# EasyEDA Pro project ProPrj_智能警报器（终版）_2025-03-04_22-10-02_2025-04-22.epro, board 警报装置新PCB
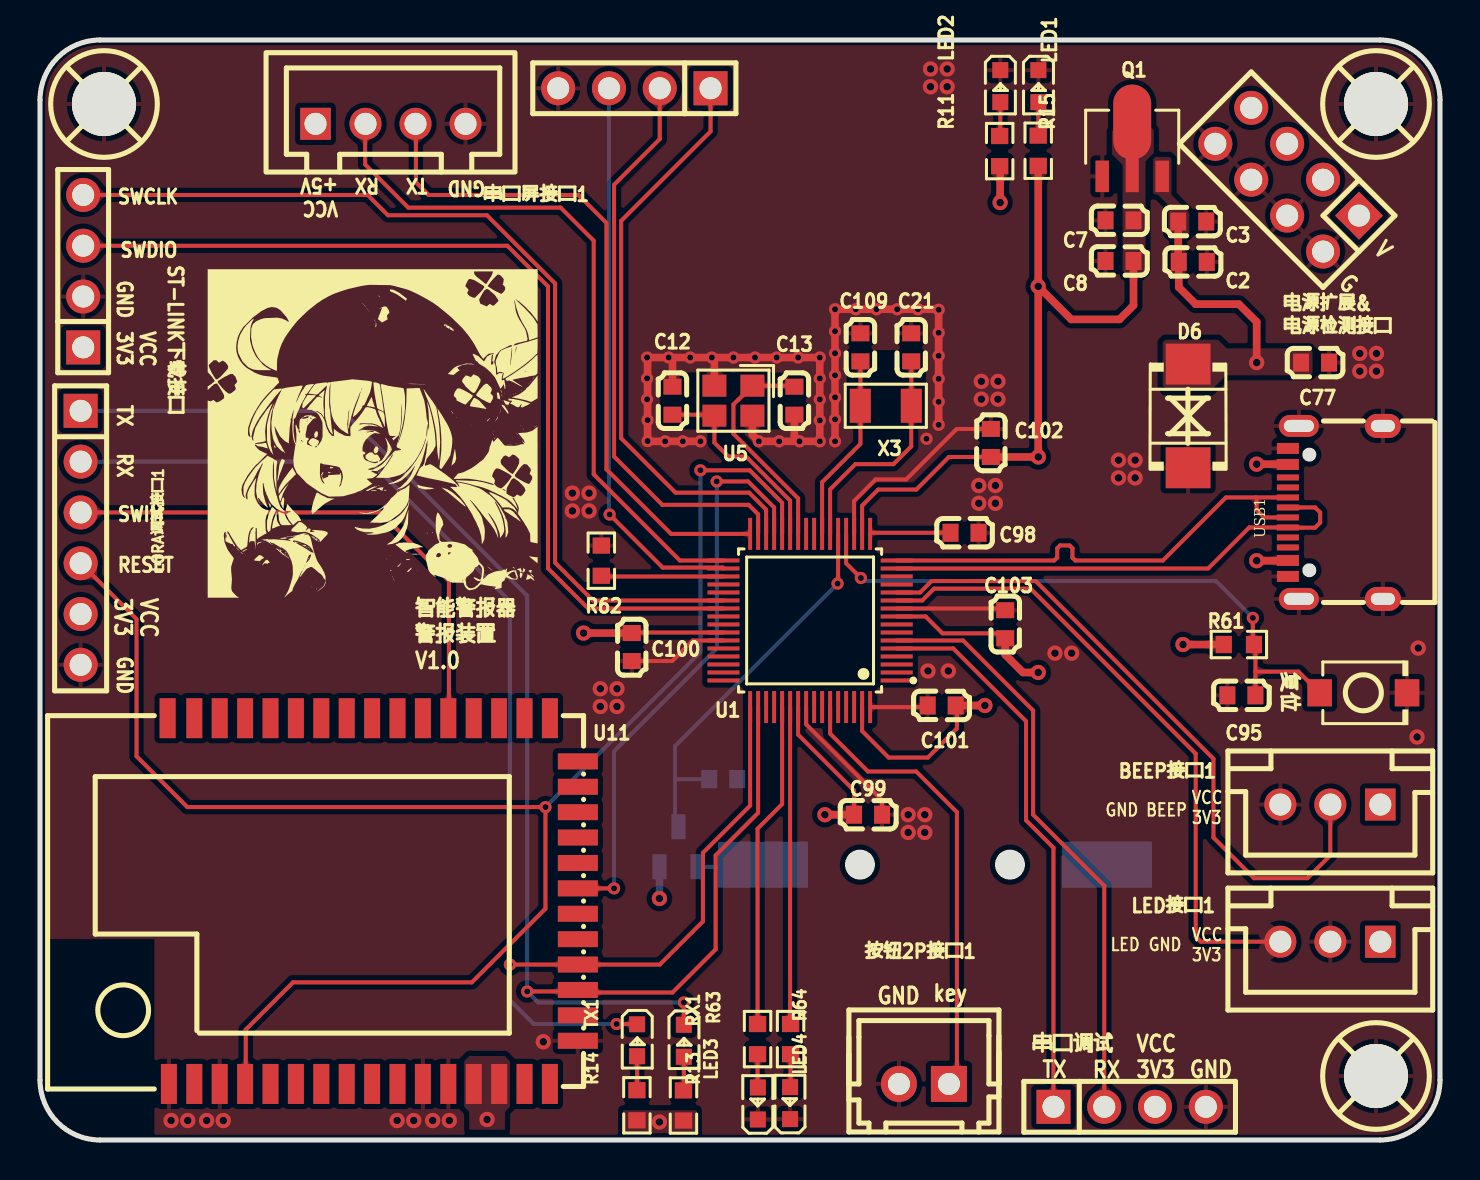
[diagram p16: board, top side]
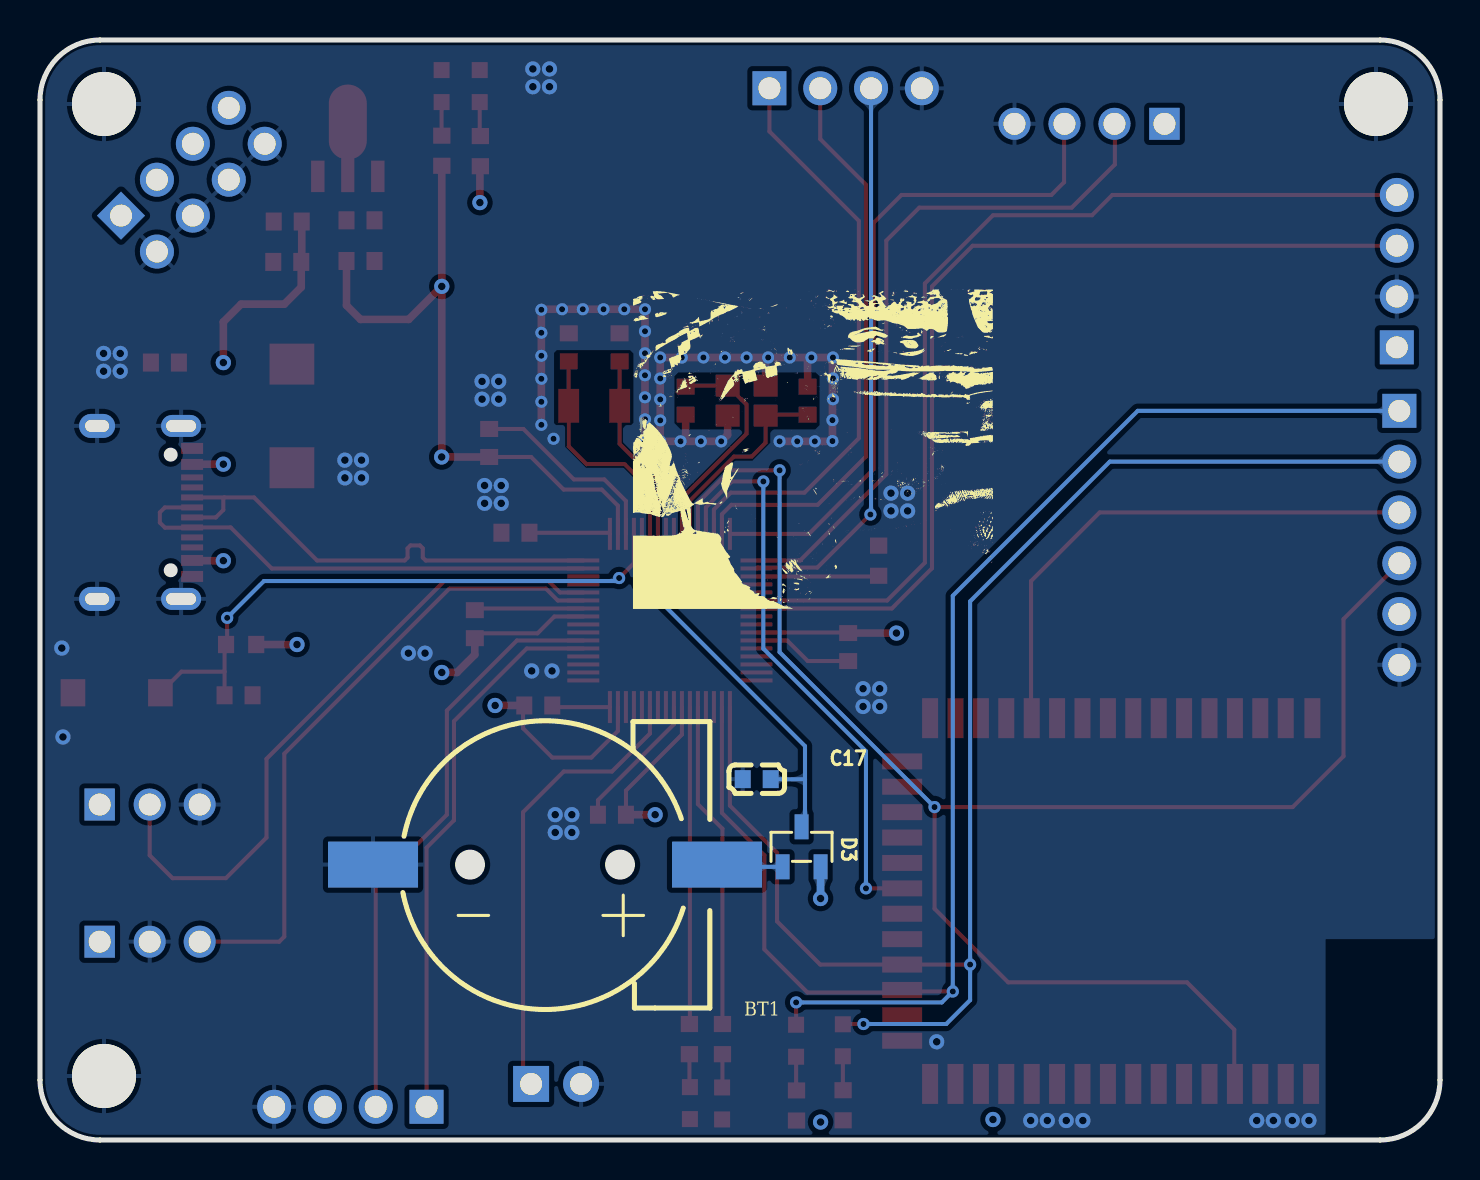
[diagram p17: board, bottom side, seen from below]

Outline 70 x 55 mm; copper layers: Top Layer, 电源层, 接地层, Bottom Layer. Coordinates in mm from the lower left corner of the outline.
Outline path: 0,52 0,3 arc(0.88,0.88) 3,0 67,0 arc(69.12,0.88) 70,3 70,52 arc(69.12,54.12) 67,55 3,55 arc(0.88,54.12) 0,52
Stack: Top Layer 0.035mm 外层铜厚1oz / Dielectric1 0.2104mm 7628 RC49% 8.6mil / 电源层 0.0152mm 内层铜厚 / Dielectric2 1.065mm 1.1mm H/HOZ Copper / 接地层 0.0152mm 内层铜厚 / Dielectric3 0.2104mm 7628 RC49% 8.6mil / Bottom Layer 0.035mm 外层铜厚1oz

## Design rules (mm)
net USBDM: DP1
net USBDP: DP1
template: 自定义配置
spacing copperThickness1oz (default): track to track 0.152, other pairs 0.152 to 0.3
spacing copperThickness2oz: track to track 0.203, other pairs 0.152 to 0.3
spacing copperThicknessInner0.5oz: track to track 0.089, other pairs 0.152 to 0.3
track width copperThickness1oz (default): min 0.203, default 0.203, max 2.54
track width copperThickness2oz: min 0.203, default 0.254, max 2.54
track width GND: min 0.203, default 0.381, max 2.54
track width vcc: min 0.203, default 0.381, max 2.54
differential pair differentialPair (default): width min 0.203, default 0.203, max 2.54; gap min 0.152, default 0.152
via viaSize (default): diameter min 0.3, default 0.61, max 10; hole min 0.201, default 0.305, max 6.299
via vcc: diameter min 0.61, default 0.762, max 1.016; hole min 0.305, default 0.381, max 0.508
net VCC+3.3V uses vcc
net GND uses GND
net VCC+5V uses vcc
net USBDM uses copperThickness2oz
net USBDP uses copperThickness2oz

## Placement (name value [footprint] x y rotation side)
BEEP接口1  ZX-XH2.54-3PZZ-R  [CONN-TH_3P-P2.50_ZX-XH2.54-3PZZ-R]  64.52 16.77 180 top
BT1  CR1220-2ZX  [BAT-SMD_CR1220-2ZX]  44.75 13.77 0 bottom
C2  10uF  [C0603]  57.64 43.91 180 top
C3  100nF  [C0603]  57.61 45.92 180 top
C7  10uF  [C0603]  53.97 45.98 0 top
C8  100nF  [C0603]  53.97 43.95 0 top
C12  12pF  [C0603]  31.62 36.97 90 top
C13  12pF  [C0603]  37.72 36.97 270 top
C17  100nF  [C0603]  34.16 18.04 0 bottom
C21  10pF  [C0603]  43.56 39.63 270 top
C77  10uF  [C0603]  63.75 38.87 180 top
C95  10uF  [C0603]  60.07 22.23 0 top
C98  2.2uF  [C0603]  46.23 30.36 0 top
C99  100nF  [C0603]  41.4 16.27 180 top
C100  100nF  [C0603]  29.59 24.65 90 top
C101  100nF  [C0603]  45.09 21.73 0 top
C102  100nF  [C0603]  47.54 34.85 270 top
C103  100nF  [C0603]  48.26 25.79 270 top
C109  10pF  [C0603]  41.02 39.63 270 top
D3  BAT54C  [SOT-23-3_L2.9-W1.3-P1.90-LS2.4-BR]  31.92 14.66 270 bottom
D6  SMBJ6.8CA  [SMB_L4.6-W3.6-LS5.3-BI]  57.4 36.2 270 top
H8  PZ254V-11-04P  [HDR-TH_4P-P2.54-V-M]  2.16 43.44 90 top
H9  PZ254V-11-04P  [HDR-TH_4P-P2.54-V-M]  29.72 52.59 180 top
LED1  KT-0603R  [LED0603-RD]  49.92 52.69 270 top
LED2  KT-0603R  [LED0603-RD]  48.01 52.69 270 top
LED3  KT-0603R  [LED0603-RD]  35.89 1.83 90 top
LED4  KT-0603R  [LED0603-RD]  37.5 1.84 90 top
LED接口1  ZX-XH2.54-3PZZ-R  [CONN-TH_3P-P2.50_ZX-XH2.54-3PZZ-R]  64.52 9.92 180 top
LORA调试接口1  PZ254-1-06-Z-2.5-G1  [HDR-TH_6P-P2.54-V-M]  2.03 30.11 270 top
Q1  AMS1117-3.3V  [SOT-89-3_L4.5-W2.5-P1.50-LS4.2-BR]  54.61 49.54 270 top
R11  1kΩ  [R0603]  47.98 49.44 270 top
R13  1kΩ  [R0603]  32.17 1.73 270 top
R14  1kΩ  [R0603]  29.84 1.74 270 top
R15  1kΩ  [R0603]  49.91 49.46 270 top
R61  10kΩ  [R0603]  59.94 24.77 180 top
R62  10kΩ  [R0603]  28.07 28.97 270 top
R63  1kΩ  [R0603]  35.88 5.04 90 top
R64  1kΩ  [R0603]  37.53 5.04 90 top
RX1  KT-0603R  [LED0603-RD]  32.19 4.96 270 top
SCREW1  -  [M3螺丝]  66.8 51.8 0 top
SCREW2  -  [M3螺丝]  66.8 3.2 0 top
SCREW3  -  [M3螺丝]  3.2 51.8 0 top
SW1  TS-1088-AR02016  [SW-SMD_L3.9-W3.0-P4.45]  66.17 22.36 0 top
TX1  KT-0603R  [LED0603-RD]  29.86 4.99 270 top
U1  HT32F52352  [LQFP-64_L7.0-W7.0-P0.40-LS9.2-BL]  38.5 25.98 90 top
U5  8MHz  [CRYSTAL-SMD_4P-L2.5-W2.0-BL]  34.67 36.97 180 top
U11  WH-L101-L-C  [COMM-SMD_WH-L101-L-C]  16.64 11.95 90 top
U59  PM254-1-04-Z-8.5  [HDR-TH_4P-P2.54-V-F]  54.48 1.66 0 top
USB1  TYPE-C 16PIN 2MD(073)  [USB-C-SMD_TYPE-C-6PIN-2MD-073]  64.77 31.38 90 top
X3  32.768kHz  [OSC-SMD_L3.2-W1.5]  42.29 36.71 180 top
串口屏接口1  ZX-XH2.54-4PZZ  [CONN-TH_4P-P2.50_4PIN]  17.53 50.81 0 top
扩展电源接口1  PZ254V-12-8P  [HDR-TH_8P-P2.54-V-M-R2-C4-S2.54]  62.36 48.02 135 top
按钮2P接口1  ZX-XH2.54-2PZZ  [CONN-TH_2P-P2.50_HX25003-2A]  44.2 2.8 180 top

## Footprints (pads in the part's own frame, mm; a bottom-side part is the same pattern mirrored in y, then rotated)
BAT-SMD_CR1220-2ZX
  rect 4.5x2.3 smd: 1(-8.6,0) 2(8.6,0)
C0603
  rect 0.8x0.9 smd: 1(-0.7,0) 2(0.7,0)
COMM-SMD_WH-L101-L-C
  rect 2x0.8 smd: 1(-9.144,10.192) 2(-9.144,8.922) 3(-9.144,7.652) 4(-9.144,6.382) 5(-9.144,5.112) 6(-9.144,3.842) 7(-9.144,2.572) 8(-9.144,1.302) 9(-9.144,0.032) 10(-9.144,-1.238) 11(-9.144,-2.509) 12(-9.144,-3.779) 13(-9.144,-5.048) 14(-9.144,-6.319) 15(-9.144,-7.588) 16(-9.144,-8.858) 29(9.144,-8.858) 30(9.144,-7.588) 31(9.144,-6.319) 32(9.144,-5.048) 33(9.144,-3.779) 34(9.144,-2.509) 35(9.144,-1.238) 36(9.144,0.032) 37(9.144,1.302) 38(9.144,2.572) 39(9.144,3.842) 40(9.144,5.112) 41(9.144,6.382) 42(9.144,7.652) 43(9.144,8.922) 44(9.144,10.255)
  rect 0.8x2 smd: 17(-6.985,-10.255) 18(-5.715,-10.255) 19(-4.445,-10.255) 20(-3.175,-10.255) 21(-1.905,-10.255) 22(-0.635,-10.255) 23(0.635,-10.255) 24(1.905,-10.255) 25(3.175,-10.255) 26(4.445,-10.255) 27(5.715,-10.255) 28(6.985,-10.255)
CONN-TH_2P-P2.50_HX25003-2A
  rect 1.8x1.8 hole 1.1: 1(-1.25,0)
  round 1.8 hole 1.1: 2(1.25,0)
CONN-TH_3P-P2.50_ZX-XH2.54-3PZZ-R
  rect 1.524x1.6 hole 1.1: 1(-2.5,0)
  round 1.6 hole 1.1: 2(0,0) 3(2.5,0)
CONN-TH_4P-P2.50_4PIN
  rect 1.524x1.6 hole 1.1: 1(-3.75,0)
  round 1.6 hole 1.1: 2(-1.25,0) 3(1.25,0) 4(3.75,0)
CRYSTAL-SMD_4P-L2.5-W2.0-BL
  rect 1.2x1.1 smd: 1(-0.95,-0.75) 2(0.95,-0.75) 3(0.95,0.75) 4(-0.95,0.75)
HDR-TH_4P-P2.54-V-F
  rect 1.7x1.7 hole 1.1: 1(-3.81,0)
  round 1.7 hole 1.1: 2(-1.27,0) 3(1.27,0) 4(3.81,0)
HDR-TH_4P-P2.54-V-M
  rect 1.7x1.7 hole 1.1: 1(-3.81,0)
  round 1.7 hole 1.1: 2(-1.27,0) 3(1.27,0) 4(3.81,0)
HDR-TH_6P-P2.54-V-M
  rect 1.7x1.7 hole 1.1: 1(-6.35,0)
  round 1.7 hole 1.1: 2(-3.81,0) 3(-1.27,0) 4(1.27,0) 5(3.81,0) 6(6.35,0)
HDR-TH_8P-P2.54-V-M-R2-C4-S2.54
  rect 1.7x1.7 hole 1.1: 1(-3.81,-1.27)
  round 1.7 hole 1.1: 2(-3.81,1.27) 3(-1.27,-1.27) 4(-1.27,1.27) 5(1.27,-1.27) 6(1.27,1.27) 7(3.81,-1.27) 8(3.81,1.27)
LED0603-RD
  rect 0.8x0.8 smd: 1(-0.799,0) 2(0.799,0)
LQFP-64_L7.0-W7.0-P0.40-LS9.2-BL
  rect 0.2x1.6 smd: 1(-3,-4.33) 2(-2.6,-4.33) 3(-2.2,-4.33) 4(-1.8,-4.33) 5(-1.4,-4.33) 6(-1,-4.33) 7(-0.6,-4.33) 8(-0.2,-4.33) 9(0.2,-4.33) 10(0.6,-4.33) 11(1,-4.33) 12(1.4,-4.33) 13(1.8,-4.33) 14(2.2,-4.33) 15(2.6,-4.33) 16(3,-4.33) 33(3,4.33) 34(2.6,4.33) 35(2.2,4.33) 36(1.8,4.33) 37(1.4,4.33) 38(1,4.33) 39(0.6,4.33) 40(0.2,4.33) 41(-0.2,4.33) 42(-0.6,4.33) 43(-1,4.33) 44(-1.4,4.33) 45(-1.8,4.33) 46(-2.2,4.33) 47(-2.6,4.33) 48(-3,4.33)
  rect 1.6x0.2 smd: 17(4.33,-3) 18(4.33,-2.6) 19(4.33,-2.2) 20(4.33,-1.8) 21(4.33,-1.4) 22(4.33,-1) 23(4.33,-0.6) 24(4.33,-0.2) 25(4.33,0.2) 26(4.33,0.6) 27(4.33,1) 28(4.33,1.4) 29(4.33,1.8) 30(4.33,2.2) 31(4.33,2.6) 32(4.33,3) 49(-4.33,3) 50(-4.33,2.6) 51(-4.33,2.2) 52(-4.33,1.8) 53(-4.33,1.4) 54(-4.33,1) 55(-4.33,0.6) 56(-4.33,0.2) 57(-4.33,-0.2) 58(-4.33,-0.6) 59(-4.33,-1) 60(-4.33,-1.4) 61(-4.33,-1.8) 62(-4.33,-2.2) 63(-4.33,-2.6) 64(-4.33,-3)
M3螺丝
  round 3.2 hole 3.2: 1(0,0)
OSC-SMD_L3.2-W1.5
  rect 1.05x1.7 smd: 1(-1.275,0) 2(1.275,0)
R0603
  rect 0.806x0.864 smd: 1(-0.753,0) 2(0.753,0)
SMB_L4.6-W3.6-LS5.3-BI
  rect 2.047x2.241 smd: 1(-2.591,0) 2(2.591,0)
SOT-23-3_L2.9-W1.3-P1.90-LS2.4-BR
  rect 1.25x0.7 smd: 1(1,-0.95) 2(1,0.95) 3(-1,0)
SOT-89-3_L4.5-W2.5-P1.50-LS4.2-BR
  rect 1.575x0.672 smd: 1(1.356,-1.5) 3(1.356,1.5)
  custom 5.377x1.9 smd: 2(-1.356,0)
SW-SMD_L3.9-W3.0-P4.45
  rect 1.23x1.36 smd: 1(-2.185,0) 2(2.185,0)
USB-C-SMD_TYPE-C-6PIN-2MD-073
  rect 0.55x1.1 smd: 1(-3.2,2.375) 2(-2.4,2.375) 11(2.4,2.375) 12(3.2,2.375)
  rect 0.3x1.1 smd: 3(-1.75,2.375) 4(-1.25,2.375) 5(-0.75,2.375) 6(-0.25,2.375) 7(0.25,2.375) 8(0.75,2.375) 9(1.25,2.375) 10(1.75,2.375)
  oval 1.1x2 hole 0.6x1.5: 13(-4.325,1.825) 14(4.325,1.825)
  oval 1.2x1.8 hole 0.6x1.2: 13(-4.325,-2.375) 14(4.325,-2.375)

## Nets
As in the schematic.

Pads without a net: U1 24; U11 2 5 6 7 8 9 10 15 16 18 21 22 24 25 26 27 28 29 30 31 32 34 35 36 37 38 39 40 41 42 43 44; USB1 3 4 9 10

## Via types
v1: diameter 0.762, hole 0.381, Top Layer to Bottom Layer, 61 vias
v2: diameter 0.61, hole 0.305, Top Layer to Bottom Layer, 53 vias

## Routing (per net, layer and track width the routed paths; a pad name or vN(x,y) marks a point on that pad's centre or on a via; arc(x,y) is an arc through that point)
GND: length 76.4
  Top Layer w0.203: U1.19 40.7,31.95 41.78,33.03 43.31,33.03 45.83,35.55 C102.1 ; C99.1 42.1,16.99 38.3,20.79 U1.56 ; U1.43 32.64,24.98 31.61,23.95 C100.1 ; U1.10 48.17,26.58 C103.1 ; 44.38,21.73 44.31,21.65 U1.64
  Top Layer w0.381: v2(31.43,39.12) v2(32.51,39.12) v2(33.59,39.12) ; v2(31.43,39.12) v2(30.35,39.12) 30.38,39.1 v2(30.38,35.99) v2(30.38,34.95) 30.39,34.93 v2(31.26,34.93) v2(32.14,34.93) v2(33.02,34.93) ; v2(31.43,39.12) 31.62,38.93 C12.2 ; v2(39.75,34.93) v2(39.75,36.03) v2(39.75,37.14) v2(39.75,38.24) v2(39.75,39.34) v2(39.75,40.44) v2(39.75,41.54) v2(40.79,41.54) v2(41.82,41.54) v2(42.86,41.54) v2(43.9,41.54) 44.91,41.54 v2(44.93,41.51) v2(44.93,40.36) v2(44.93,39.21) v2(44.93,38.06) v2(44.93,36.91) v2(44.93,35.76) ; C13.2 37.72,35.19 v2(37.97,34.93) ; v2(33.59,39.12) 33.72,39 U5.2 ; v2(33.59,39.12) v2(34.67,39.12) v2(35.75,39.12) v2(36.83,39.12) v2(37.91,39.12) v2(38.99,39.12) v2(38.99,38.08) v2(38.99,37.03) v2(38.99,35.98) v2(38.99,34.93) v2(37.97,34.93) ; U5.4 35.62,35.25 v2(35.94,34.93) v2(36.96,34.93) v2(37.97,34.93)
  vias: v1(6.55,0.97) v1(7.39,0.97) v1(8.33,0.97) v1(9.16,0.97) v1(17.86,0.97) v1(18.69,0.97) v1(19.63,0.97) v1(20.47,0.97) v1(25.16,4.91) v1(26.62,32.34) v1(26.62,31.45) v1(27.45,31.45) v1(27.45,32.34) v1(28.02,22.56) v1(28.02,21.67) v1(28.85,22.56) v1(28.85,21.67) v1(43.41,16.27) v1(43.41,15.38) v1(44.24,16.27) v1(44.24,15.38) v1(44.4,23.45) v1(44.53,53.55) v1(44.53,52.66) v1(45.36,53.55) v1(45.36,52.66) v1(45.41,23.45) v1(46.94,32.72) v1(46.94,31.83) v1(47.07,37.93) v1(47.07,37.04) v1(47.77,32.72) v1(47.77,31.83) v1(47.9,37.93) v1(47.9,37.04) v1(50.75,24.34) v1(51.58,24.34) v1(53.92,33.99) v1(53.92,33.11) v1(54.76,33.99) v1(54.75,33.11) v1(65.99,39.33) v1(65.99,38.44) v1(66.82,39.33) v1(66.82,38.44) v1(68.91,24.6) v1(68.85,20.15) v2(30.35,38.08) v2(30.35,37.04) v2(44.32,35.06)
VBAT: length 19.8
  Top Layer w0.203: U1.21 39.9,27.85 v2(39.88,27.82)
  Bottom Layer w0.203: 31.75,18.04 31.75,15.83 D3.3 ; 31.75,18.04 33.46,18.04 C17.1 ; 31.75,18.04 31.75,19.69 v2(39.88,27.82)
VCC+3.3V: length 267.9
  Top Layer w0.203: C103.2 48.02,25.33 45.12,25.33 44.28,26.18 U1.9 ; U1.18 41.1,31.72 41.91,32.52 43.81,32.52 45.45,34.15 C102.2 ; C101.2 45.85,21.66 45.85,20.58 44.39,19.12 42.43,19.12 41.1,20.45 U1.63 ; U1.42 29.62,25.38 C100.2 ; C99.2 40.7,17.47 37.9,20.27 U1.55
  Top Layer w0.381: v1(49.91,42.68) 49.91,34.16 v1(49.92,34.15) C102.2 ; v1(49.91,42.68) 51.56,41.03 53.97,41.03 54.68,41.73 54.68,43.95 ; v1(49.91,42.68) R15.2 ; C103.2 48.26,24.27 49.15,23.38 v1(49.91,23.38) ; C101.2 v1(47.24,21.73) ; v1(57.15,24.77) R61.2 ; C100.2 v1(27.18,25.35) ; C99.2 v1(39.24,16.27)
  电源层 w0.381: 67.02,13.26 LED接口1.1 ; 67.02,13.26 BEEP接口1.1 ; 67.02,13.26 66.97,13.22 55.75,13.22 ; 49.89,17.58 39.22,17.58 ; 49.89,17.58 49.91,17.6 49.91,21.7 ; 49.89,17.58 49.89,15.14 51.82,13.22 55.75,13.22 ; 39.22,17.58 39.24,17.55 v1(39.24,16.27) ; 39.22,17.58 30.7,17.58 ; v1(49.91,23.38) 49.91,34.15 v1(49.92,34.15) ; v1(49.91,23.38) 49.91,21.7 ; v1(49.91,23.38) 50.04,23.5 55.88,23.5 v1(57.15,24.77) ; 27.19,17.58 27.18,17.6 v1(27.18,25.35) ; 27.19,17.58 23.58,17.58 14.86,26.3 11.74,26.3 ; 27.19,17.58 30.7,17.58 ; H8.1 10.03,39.63 11.74,37.93 11.74,26.3 ; 11.74,26.3 LORA调试接口1.5 ; 55.75,13.22 U59.3 ; 49.91,21.7 49.89,21.73 v1(47.24,21.73) ; 30.7,17.58 30.97,17.31 v1(30.97,12.07) v1(30.97,0.9) 30.84,1.03 v1(22.35,1.03) ; 扩展电源接口1.5 扩展电源接口1.7 58.44,53.73 53.09,53.73 49.91,50.56 v1(49.91,42.68)
  Bottom Layer w0.381: D3.2 v1(30.97,12.07)
VCC+5V: length 96
  Top Layer w0.381: v1(60.83,28.97) 62.38,28.97 USB1.2 ; v1(60.83,38.87) 60.83,40.9 59.94,41.79 57.78,41.79 56.94,42.64 C2.2 56.91,43.93 C3.2 ; USB1.11 62.38,33.79 v1(60.83,33.79) ; 47.98,48.69 48.01,48.67 v1(48.01,46.87)
  电源层 w0.381: v1(60.83,38.87) 51.82,38.87 48.01,42.68 v1(48.01,46.87) 47.88,47 15.62,47 13.72,48.9 13.72,50.75 串口屏接口1.1 ; v1(60.83,38.87) v1(60.83,33.79) v1(60.83,28.97) ; v1(60.83,38.87) 63.5,41.54 66.93,41.54 67.83,42.44 67.83,44.33 64.15,48.02
BOOT: length 6.1
  Top Layer w0.203: R62.2 28.1,28.18 U1.35
LCD_RX: length 35
  Top Layer w0.203: 串口屏接口1.2 16.26,50.79 16.26,48.78 18.41,46.62 26.03,46.62 27.69,44.97 27.69,33.28 31.99,28.98 U1.33
LCD_TX: length 34.1
  Top Layer w0.203: 串口屏接口1.3 18.8,50.79 18.8,47.89 19.43,47.25 26.92,47.25 28.32,45.86 28.32,33.54 31.55,30.31 U1.32
LORA_RESET: length 84
  Top Layer w0.203: LORA调试接口1.4 4.83,26.04 4.83,19.19 7.37,16.65 v2(25.27,16.65) 25.27,11.57 21.59,7.88 12.65,7.88 10.29,5.52 10.29,2.83 U11.4 ; v2(33.02,33.49) 35.48,33.49 37.1,31.87 U1.28
  Bottom Layer w0.203: v2(25.27,16.65) 33.02,24.39 v2(33.02,33.49)
LORA_RX: length 73.4
  Top Layer w0.203: U1.49 35.5,16.72 33.15,14.36 33.15,10.93 30.99,8.77 U11.20 v2(23.5,8.77) ; TX1.1 29.84,5.8 v2(28.83,5.8)
  Bottom Layer w0.203: v2(28.83,5.8) 24.69,5.8 23.5,6.99 v2(23.5,8.77) 23.5,26.93 16.51,33.92 LORA调试接口1.2
LORA_SWIM: length 26.7
  Top Layer w0.203: U11.33 20.45,21.12 20.45,27.95 17.02,31.38 LORA调试接口1.3
LORA_TX: length 78.5
  Top Layer w0.203: U1.50 35.9,16.36 33.78,14.23 33.78,9.53 31.62,7.38 27.02,7.38 U11.19 26.82,7.43 v2(24.36,7.43) ; v2(32.19,6.88) RX1.1
  Bottom Layer w0.203: LORA调试接口1.1 15.11,36.46 24.36,27.21 v2(24.36,7.43) 24.91,6.88 v2(32.19,6.88)
LORA_WAKE: length 29
  Top Layer w0.203: v2(33.83,32.93) 35.41,32.93 36.7,31.63 U1.29 ; v2(28.7,12.58) U11.23
  Bottom Layer w0.203: v2(28.7,12.58) 28.7,19.44 33.83,24.57 v2(33.83,32.93)
NRST: length 30.5
  Top Layer w0.203: 60.77,23.42 62.92,23.42 SW1.1 ; 60.77,23.42 60.77,24.7 R61.1 60.64,24.83 v2(60.64,26.11) ; 60.77,23.42 C95.2 ; U1.20 40.3,28.84 v2(41.04,28.1)
  Bottom Layer w0.203: v2(41.04,28.1) 41.19,27.95 58.8,27.95 v2(60.64,26.11)
PA4: length 27.8
  Top Layer w0.203: U1.5 45.66,24.58 49.3,20.94 49.3,15.99 50.67,14.61 U59.1
PA5: length 29.6
  Top Layer w0.203: U1.6 46.15,24.98 49.66,21.47 49.66,16.27 53.21,12.71 U59.2
PA8: length 28.1
  Top Layer w0.203: v2(28.48,31.28) 31.13,28.62 34.13,28.62 U1.34
  Bottom Layer w0.203: H9.3 28.45,31.31 v2(28.48,31.28)
PC4: length 32.1
  Top Layer w0.203: LED接口1.3 58.04,9.92 57.78,10.17 57.78,19.31 49.53,27.57 44.7,27.57 44.11,26.98 U1.11
PC5: length 33.4
  Top Layer w0.203: BEEP接口1.2 64.52,14.23 63.37,13.09 60.71,13.09 58.67,15.12 58.67,19.06 49.78,27.95 44.58,27.95 44,27.38 U1.12
PC10: length 29.3
  Top Layer w0.203: U1.30 36.3,31.52 35.46,32.37 31.78,32.37 29.06,35.09 29.06,45.96 33.53,50.43 H9.1
PC11: length 28.7
  Top Layer w0.203: U1.31 35.9,31.29 35.43,31.76 31.12,31.76 28.7,34.17 28.7,47.76 30.99,50.05 H9.2
PC14: length 16.4
  Top Layer w0.203: R63.2 35.88,15.57 37.1,16.79 U1.53
PC15: length 15.9
  Top Layer w0.203: R64.2 37.5,5.82 U1.54
STOP_KEY: length 23.1
  Top Layer w0.203: 按钮2P接口1.1 45.85,3.2 45.85,16.39 43.81,18.42 41.4,18.42 39.5,20.32 U1.59
SWCLK: length 48.6
  Top Layer w0.203: H8.4 16.38,47.25 17.4,46.24 22.35,46.24 25.76,42.83 25.76,28.86 27.64,26.98 U1.38
SWDIO: length 47.8
  Top Layer w0.203: H8.3 23.37,44.71 25.4,42.68 25.4,28.58 27.41,26.58 U1.39
USBDM: length 24.4
  Top Layer w0.203: U1.15 58.41,28.58 60.46,30.63 USB1.5 62.41,30.62 63.75,30.62 64.01,30.87 64.01,31.38 63.76,31.63 USB1.7
USBDP: length 24.4
  Top Layer w0.203: 60.78,32.13 62.39,32.13 ; 60.78,32.13 60.83,32.08 60.83,31.5 61.21,31.13 USB1.6 ; 60.78,32.13 59.3,32.13 56.15,28.98 51.77,28.98 51.62,29.12 51.62,29.58 51.48,29.73 51,29.73 50.86,29.58 50.86,29.12 50.72,28.98 U1.16
X32KIN: length 11.4
  Top Layer w0.203: U1.22 39.5,32.53 40.77,33.79 42.67,33.79 43.56,34.68 43.56,36.71 X3.1 43.57,38.93 C21.2
X32KOUT: length 9.4
  Top Layer w0.203: C109.2 41.02,36.72 X3.2 41.02,36.71 41.02,34.81 39.1,32.89 U1.23
XATLOUT: length 10.1
  Top Layer w0.203: U1.27 37.5,31.97 35.3,34.17 34.42,34.17 33.72,34.87 U5.3 33.67,36.27 C12.1
XTALIN: length 11.3
  Top Layer w0.203: U1.26 37.9,32.08 34.67,35.31 34.67,36.78 34.92,37.02 34.93,37.02 U5.1 37.67,37.72 C13.1
$1N11060: length 3.3
  Bottom Layer w0.203: BT1.1 36.04,13.66 D3.1
$1N11069: length 4
  Top Layer w0.203: C98.1 41.56,30.36 U1.17
$1N12159: length 1.7
  Top Layer w0.203: R63.1 35.88,2.64 35.89,2.63
$1N12162: length 1.7
  Top Layer w0.203: LED4.2 37.53,2.67 R64.1
$2N1998: length 1.7
  Top Layer w0.203: R14.1 29.86,2.5 TX1.2
$2N1999: length 1.7
  Top Layer w0.203: RX1.2 32.19,2.5 R13.1
$3N700: length 1.7
  Top Layer w0.203: R11.1 48.01,50.23 LED2.2
$3N701: length 1.7
  Top Layer w0.203: R15.1 49.92,50.22 LED1.2

## Copper pours and planes (outline as drawn; the poured copper is in the pictures)
GND on Top Layer: -2.41,57.16 74.42,57.16 74.42,-3.93 -2.41,-3.93
GND on Bottom Layer: -2.66,57.16 74.55,57.16 74.55,-3.93 -2.66,-3.93
GND on 接地层: -2.66,56.84 74.55,56.84 74.55,-4.06 -2.66,-4.06
VCC+3.3V on Top Layer: 21.21,4.2 23.5,4.2 23.5,0.52 21.21,0.52
VCC+3.3V on Top Layer: 29.16,1.48 32.83,1.48 32.83,0.34 29.16,0.34
VCC+3.3V on Top Layer: 53.59,50.81 55.69,50.81 55.69,43.24 53.59,43.24
VCC+5V on Top Layer: 56.13,40.01 63.63,40.01 63.63,37.47 56.13,37.47
VCC+5V on Top Layer: 55.65,49.16 57.47,49.16 57.47,45.22 55.65,45.22

Small or netless copper shapes (teardrops, artwork), in the pictures only: 201 on Top Layer, 24 on Bottom Layer, 38 on 电源层

## Text on the board
Top Silkscreen Layer: GND | LED | BEEP | VCC / 3V3 | TX | RX | SWCLK | SWIM | SWDIO | RESET | VCC / +5V | G | V | key | ST-LINK下载接口 | 电源扩展& / 电源检测接口 | 智能警报器 / 警报装置 / V1.0 | 复位 | 串口调试
